# Altium project Mod-player-proto.PrjPcb
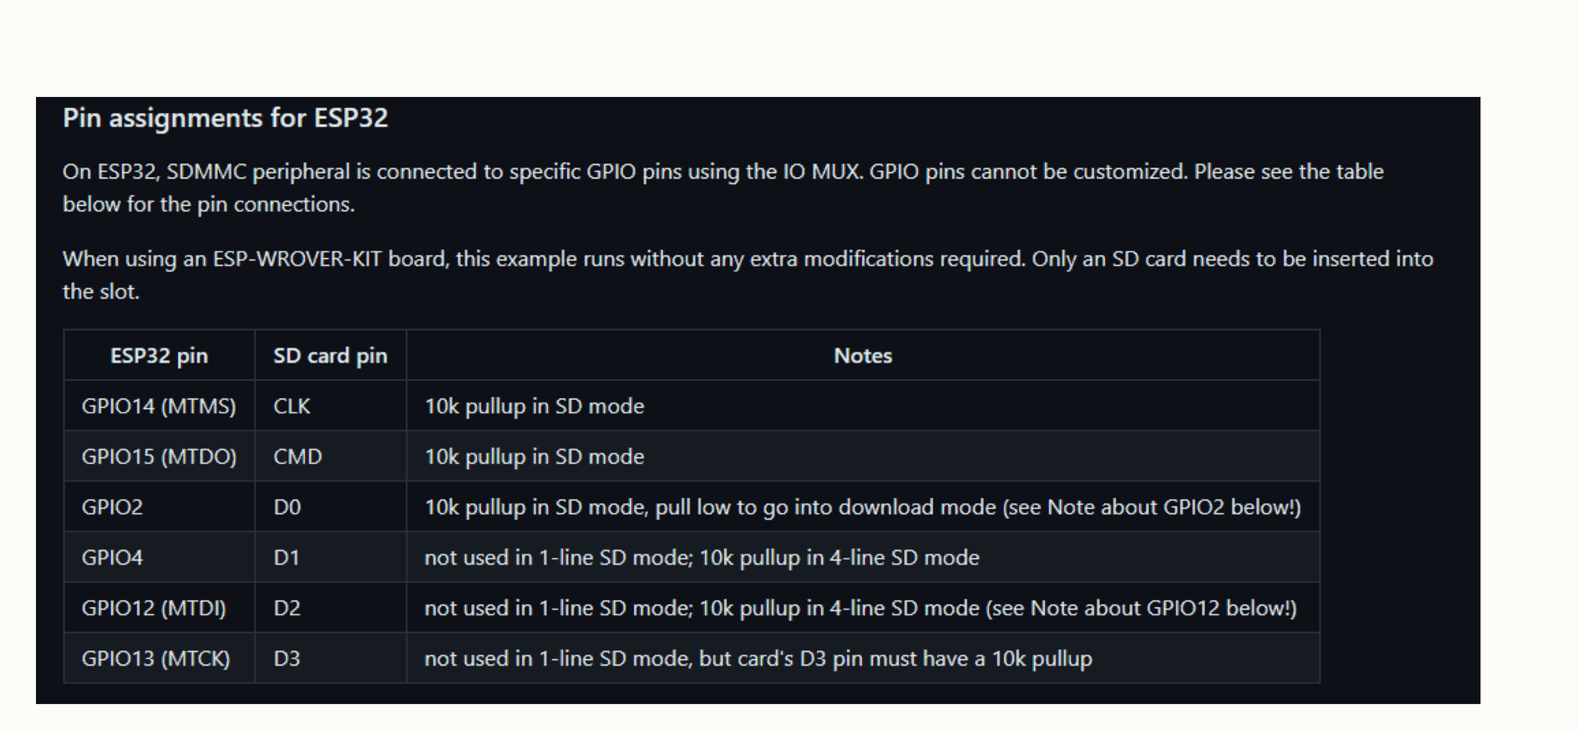
[diagram p0: Sheet1.SchDoc, top left]
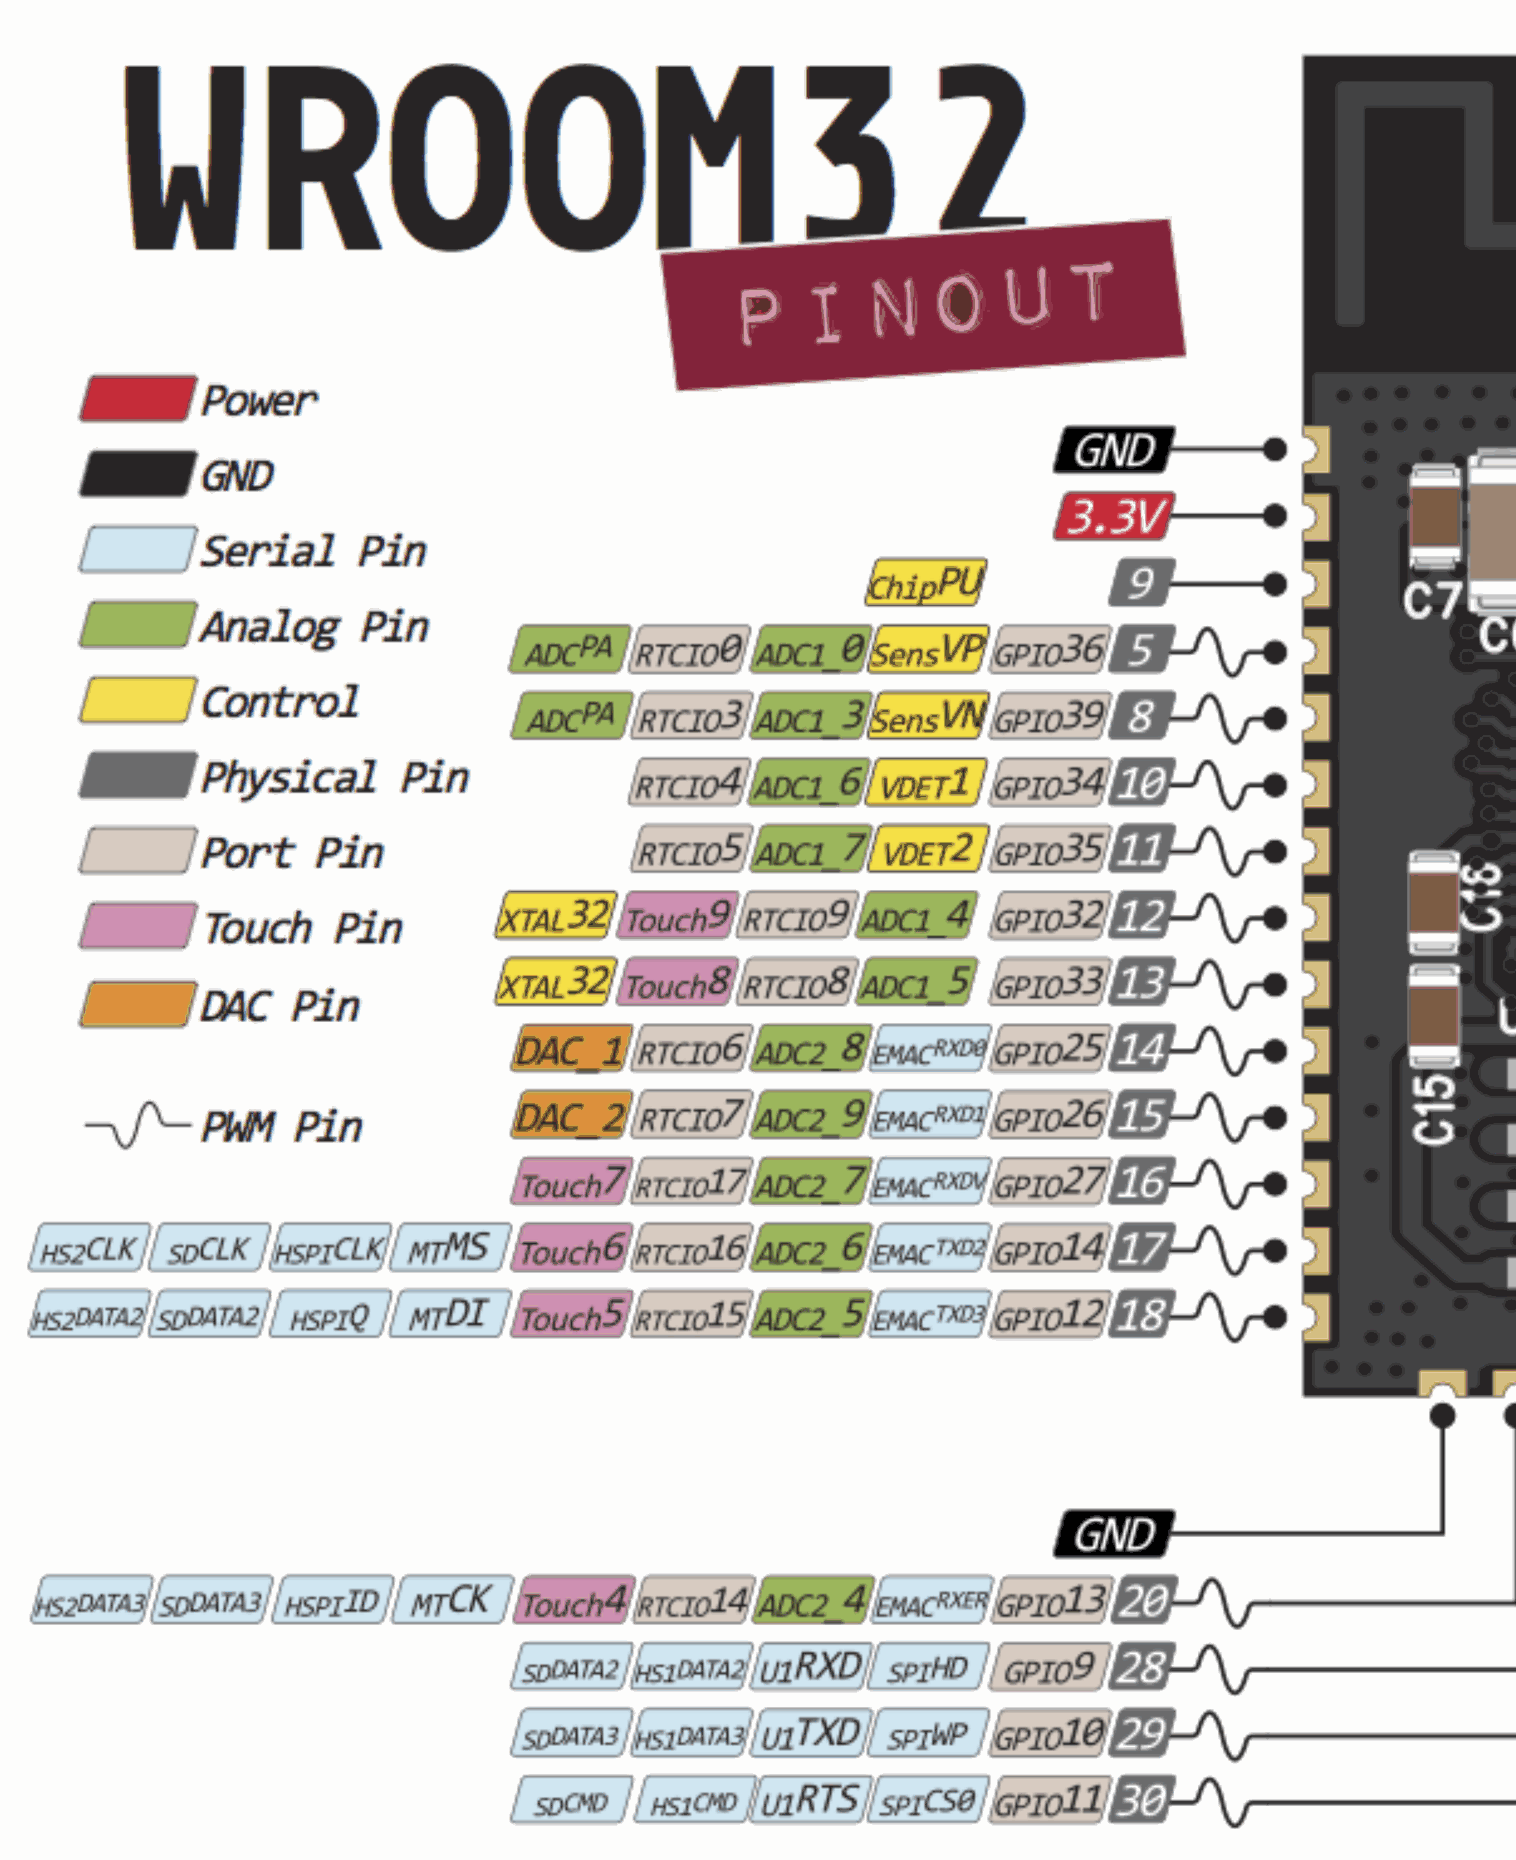
[diagram p1: Sheet1.SchDoc, top middle]
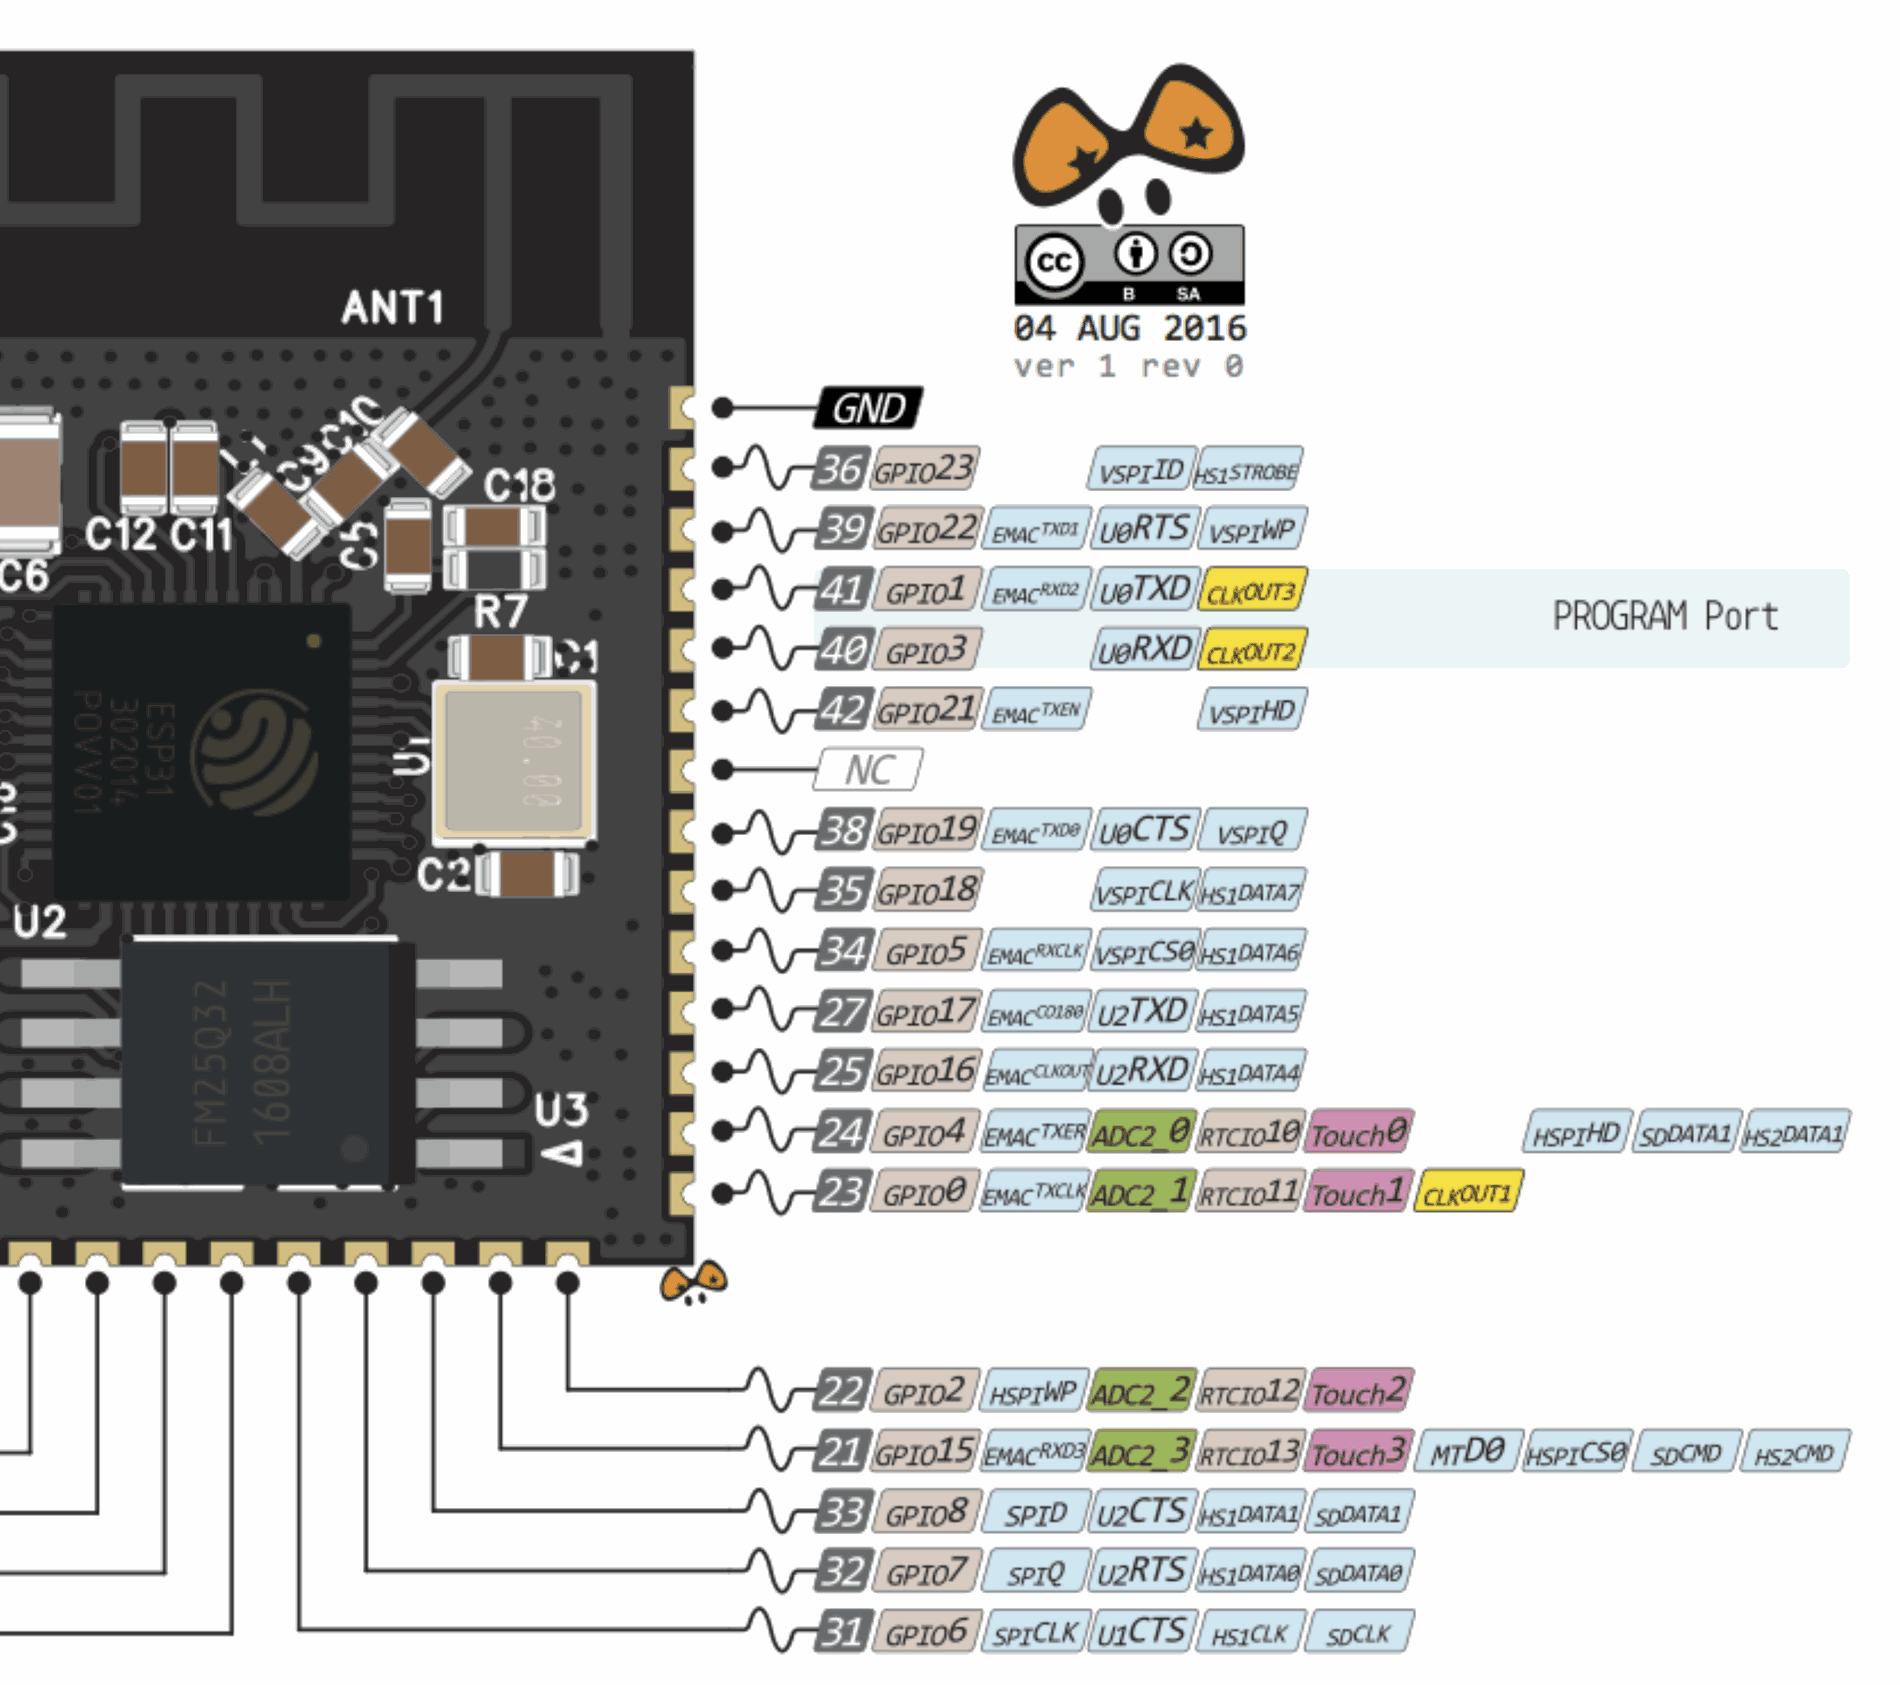
[diagram p2: Sheet1.SchDoc, top right]
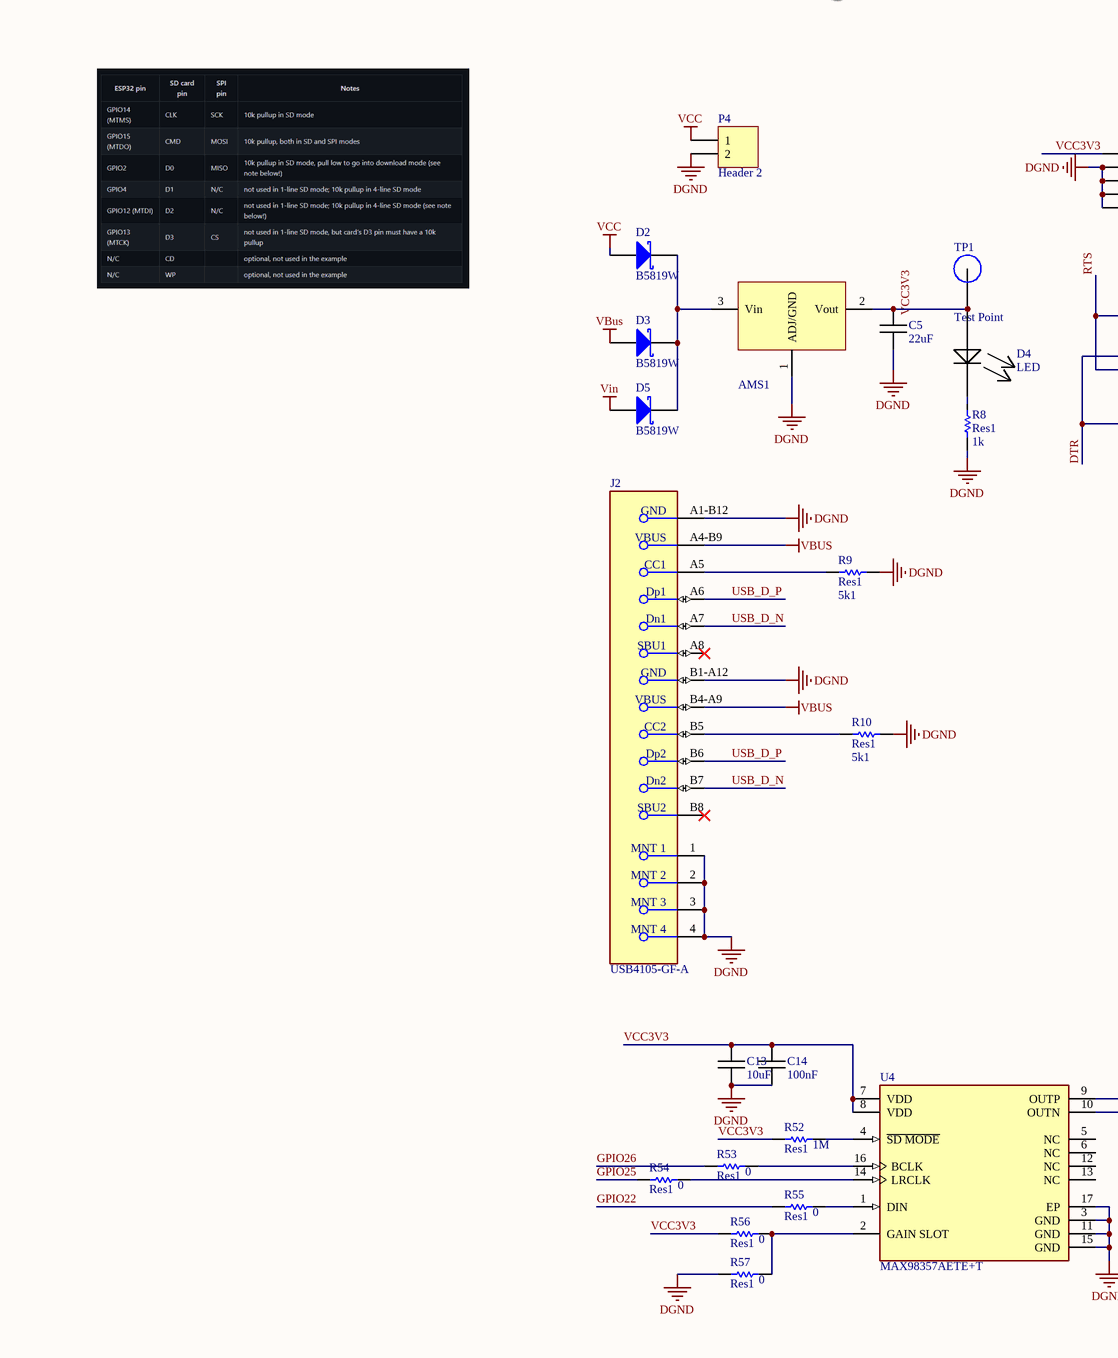
[diagram p3: Sheet1.SchDoc, bottom middle]
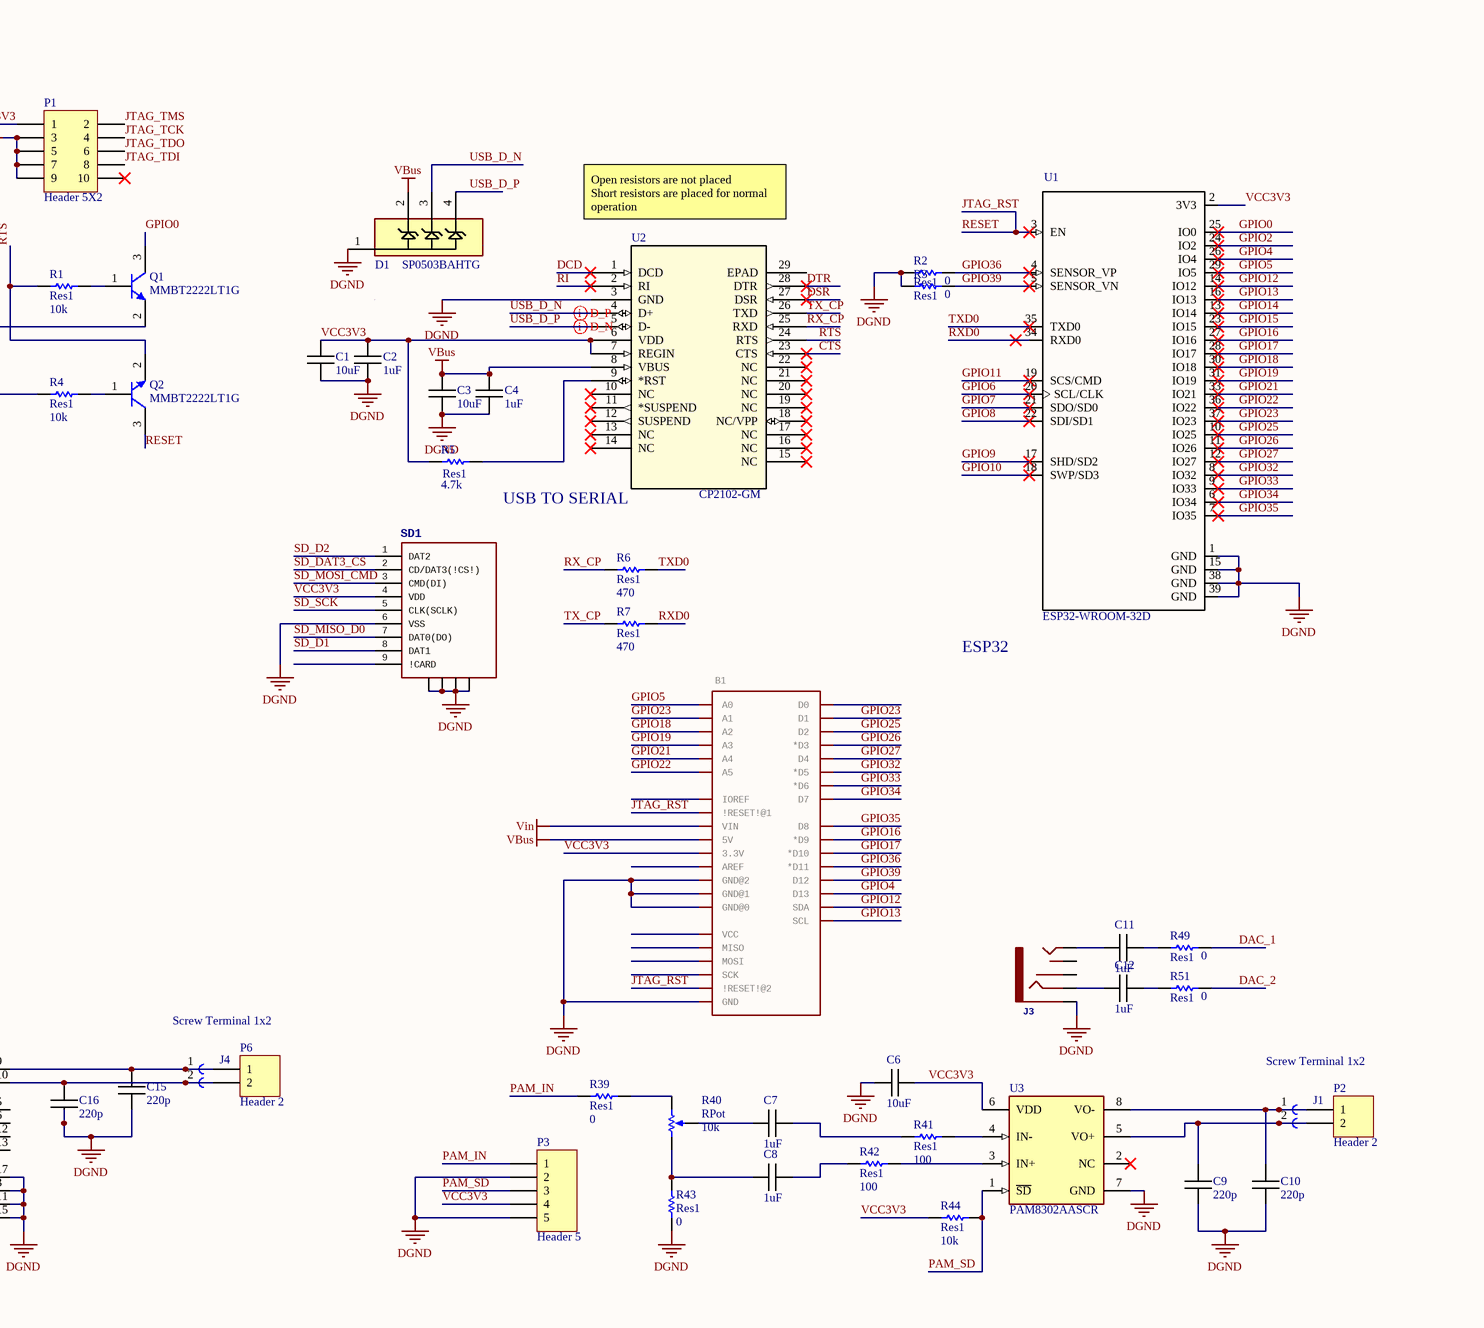
[diagram p4: Sheet1.SchDoc, bottom right]
2 sheets, 116 parts. Net scope: global (net labels, ports and power ports of the same name join across sheets).
Board file: PCB1.PcbDoc
Sheets:
  Sheet1.SchDoc
  Sheet2.SchDoc

## Sheet Sheet1.SchDoc
size B; SheetNumber: 1; SheetTotal: 2

### Parts
AMS1  AMS1117  [SOT-223-3]  (value not drawn)
B1  Arduino R3 Footprint with SPI header Arduino Uno R3 Compatible Footprint. Matches PCB size of the original board.    SparkFun Products:  SAMD21 Dev Breakout  RedBoard   R3 Stackable Headers  [ARDUINO_R3]  (value not drawn)
C1  10uF  [C 0603 / 1608]
C2  1uF  [C 0603 / 1608]
C3  10uF  [C 0603 / 1608]
C4  1uF  [C 0603 / 1608]
C5  22uF  [C 0603 / 1608]
C6  10uF  [C 0603 / 1608]
C7  1uF  [C 0603 / 1608]
C8  1uF  [C 0603 / 1608]
C9  220p  [C 0603 / 1608]
C10  220p  [C 0603 / 1608]
C11  1uF  [C 0603 / 1608]
C12  1uF  [C 0603 / 1608]
C13  10uF  [C 0603 / 1608]
C14  100nF  [C 0603 / 1608]
C15  220p  [C 0603 / 1608]
C16  220p  [C 0603 / 1608]
D1  Part Number: SP0503BAHTG  [Littelfuse_SP0503BAHTG_0]  (hidden comment: Diode_Littelfuse_SP0503BAHTG_eec)
D2  B5819W  [MCC-SOD123_V]
D3  B5819W  [MCC-SOD123_V]
D4  LED  [LED 0603(2)]
D5  B5819W  [MCC-SOD123_V]
J1  Screw Terminal 1x2  [SCREWTERMINAL-5MM-2 - duplicate]
J2  USB4105-GF-A  [FP-USB4105-GF-A-MFG]
J3  Audio Jack 3.5mm variants of PTH and SMT stereo audio jack with bypass switches.SparkFun Products:  [AUDIO-JACK-3.5MM-SMD]  (value not drawn)
J4  Screw Terminal 1x2  [SCREWTERMINAL-5MM-2 - duplicate]
P1  Header 5X2  [HDR2X5]
P2  Header 2  [HDR1X2]
P3  Header 5  [HDR1X5]
P4  Header 2  [HDR1X2]
P6  Header 2  [HDR1X2]
Q1  MMBT2222LT1G  [ONSC-SOT-23-3-318-08_M]
Q2  MMBT2222LT1G  [ONSC-SOT-23-3-318-08_M]
R1  Res1  value 10k  [C 0603 / 1608]
R2  Res1  value 0  [C 0603 / 1608]
R3  Res1  value 0  [C 0603 / 1608]
R4  Res1  value 10k  [C 0603 / 1608]
R5  Res1  value 4.7k  [C 0603 / 1608]
R6  Res1  value 470  [C 0603 / 1608]
R7  Res1  value 470  [C 0603 / 1608]
R8  Res1  value 1k  [C 0603 / 1608]
R9  Res1  value 5k1  [C 0603 / 1608]
R10  Res1  value 5k1  [C 0603 / 1608]
R39  Res1  value 0  [C 0603 / 1608]
R40  RPot  value 10k  [SMD_POT_3x3mm]
R41  Res1  value 100  [C 0603 / 1608]
R42  Res1  value 100  [C 0603 / 1608]
R43  Res1  value 0  [C 0603 / 1608]
R44  Res1  value 10k  [C 0603 / 1608]
R49  Res1  value 0  [C 0603 / 1608]
R51  Res1  value 0  [C 0603 / 1608]
R52  Res1  value 1M  [C 0603 / 1608]
R53  Res1  value 0  [C 0603 / 1608]
R54  Res1  value 0  [C 0603 / 1608]
R55  Res1  value 0  [C 0603 / 1608]
R56  Res1  value 0  [C 0603 / 1608]
R57  Res1  value 0  [C 0603 / 1608]
SD1  TF / Micro SD socket is PUSH-PUSH type, the card can be pushed into and auto locked and pushed out by simply press the card.    Surface Mounting type.  [TF-PULL]  (value not drawn)
TP1  Test Point  [Test POint]
U1  ESP32-WROOM-32D  [MODULE_ESP32-WROOM-32D]
U2  CP2102-GM  [QFN28_5X5]
U3  PAM8302AASCR  [FP-MSOP-8-MFG]
U4  MAX98357AETE+T  [FP-T1633-4-MFG]

### Nets
DGND: AMS1.1(ADJ/GND) B1.GND@1(GND) B1.GND@2(GND@0) B1.GND@3(GND@1) B1.GND@4(GND@2) C1.1 C2.1 C3.1 C4.1 C5.1 C6.1 C9.2 C10.2 C13.1 C14.1 C15.2 C16.2 D1.1(COMMON_ANODE) J2.1(MNT_1) J2.2(MNT_2) J2.3(MNT_3) J2.4(MNT_4) J2.A1-B12(GND) J2.B1-A12(GND) J3.SLEEVE P1.3 P1.5 P1.7 P1.9 P3.2 P3.5 P4.2 R2.1 R3.1 R8.2 R9.1 R10.1 R43.2 R57.1 SD1.6(VSS) SD1.S1 SD1.S2 SD1.S3 SD1.S4 U1.1(GND) U1.15(GND) U1.38(GND) U1.39(GND) U2.3(GND) U3.7(GND) U4.3(GND) U4.11(GND) U4.15(GND) U4.17(EP)
VBus: B1.5V C3.2 C4.2 D1.2(1_CATHODE) D3.1(A) J2.A4-B9(VBUS) J2.B4-A9(VBUS) U2.8(VBUS)
VCC: D2.1(A) P4.1
Vin: B1.VIN D5.1(A)
CTS: U2.23(CTS)
DAC_1: R49.2
DAC_2: R51.2
DCD: U2.1(DCD)
DSR: U2.27(DSR)
DTR: Q1.2(E) R4.1 U2.28(DTR)
GPIO0: Q1.3(C) U1.25(IO0)
GPIO2: U1.24(IO2)
GPIO4: B1.D13 U1.26(IO4)
GPIO5: B1.A0 U1.29(IO5)
GPIO6: U1.20(SCL/CLK)
GPIO7: U1.21(SDO/SD0)
GPIO8: U1.22(SDI/SD1)
GPIO9: U1.17(SHD/SD2)
GPIO10: U1.18(SWP/SD3)
GPIO11: U1.19(SCS/CMD)
GPIO12: B1.SDA U1.14(IO12)
GPIO13: B1.SCL U1.16(IO13)
GPIO14: U1.13(IO14)
GPIO15: U1.23(IO15)
GPIO16: B1.D9(*D9) U1.27(IO16)
GPIO17: B1.D10(*D10) U1.28(IO17)
GPIO18: B1.A2 U1.30(IO18)
GPIO19: B1.A3 U1.31(IO19)
GPIO21: B1.A4 U1.33(IO21)
GPIO22: B1.A5 R55.1 U1.36(IO22)
GPIO23: B1.A1 B1.D1 U1.37(IO23)
GPIO25: B1.D2 R54.1 U1.10(IO25)
GPIO26: B1.D3(*D3) R53.1 U1.11(IO26)
GPIO27: B1.D4 U1.12(IO27)
GPIO32: B1.D5(*D5) U1.8(IO32)
GPIO33: B1.D6(*D6) U1.9(IO33)
GPIO34: B1.D7 U1.6(IO34)
GPIO35: B1.D8 U1.7(IO35)
GPIO36: B1.D11(*D11) R2.2 U1.4(SENSOR_VP)
GPIO39: B1.D12 R3.2 U1.5(SENSOR_VN)
JTAG_RST: B1.RESET@1(!RESET!@1) B1.RESET@2(!RESET!@2) Q2.3(C) U1.3(EN)  [also labelled RESET]
JTAG_TCK: P1.4
JTAG_TDI: P1.8
JTAG_TDO: P1.6
JTAG_TMS: P1.2
PAM_IN: P3.1 R39.1
PAM_SD: P3.3 R44.1 U3.1(~{SD})
RI: U2.2(RI)
RTS: Q2.2(E) R1.1 U2.24(RTS)
RX_CP: R6.1 U2.25(RXD)
RXD0: R7.2 U1.34(RXD0)
SD_D1: SD1.8(DAT1)
SD_D2: SD1.1(DAT2)
SD_DAT3_CS: SD1.2(CD/DAT3(!CS!))
SD_MISO_D0: SD1.7(DAT0(DO))
SD_MOSI_CMD: SD1.3(CMD(DI))
SD_SCK: SD1.5(CLK(SCLK))
TX_CP: R7.1 U2.26(TXD)
TXD0: R6.2 U1.35(TXD0)
USB_D_N: D1.3(2_CATHODE) J2.A7(Dn1) J2.B7(Dn2) U2.4(D+)
USB_D_P: D1.4(3_CATHODE) J2.A6(Dp1) J2.B6(Dp2) U2.5(D-)
VCC3V3: B1.3.3V C1.2 C2.2 C6.2 C13.2 C14.2 P1.1 P3.4 R5.1 R44.2 R52.1 R56.1 SD1.4(VDD) U1.2(3V3) U2.6(VDD) U2.7(REGIN) U3.6(VDD) U4.7(VDD) U4.8(VDD)
NetAMS1_2: AMS1.2(Vout) C5.2 D4.1(+) TP1.1
NetAMS1_3: AMS1.3(Vin) D2.2(K) D3.2(K) D5.2(K)
NetC7_1: C7.1 R41.2
NetC7_2: C7.2 R40.2(TAP)
NetC8_1: C8.1 R42.2
NetC8_2: C8.2 R40.1(TOP) R43.1
NetC9_1: C9.1 J1.2 P2.2 U3.5(VO+)
NetC10_1: C10.1 J1.1 P2.1 U3.8(VO-)
NetC11_1: C11.1 R49.1
NetC11_2: C11.2 J3.TIP
NetC12_1: C12.1 R51.1
NetC12_2: C12.2 J3.RING
NetC15_1: C15.1 J4.1 P6.1 U4.9(OUTP)
NetC16_1: C16.1 J4.2 P6.2 U4.10(OUTN)
NetD4_2: D4.2(-) R8.1
NetJ2_A5: J2.A5(CC1) R9.2
NetJ2_B5: J2.B5(CC2) R10.2
NetQ1_1: Q1.1(B) R1.2
NetQ2_1: Q2.1(B) R4.2
NetR5_2: R5.2 U2.9(*RST)
NetR39_2: R39.2 R40.3(BOT)
NetR41_1: R41.1 U3.4(IN-)
NetR42_1: R42.1 U3.3(IN+)
NetR52_2: R52.2 U4.4(~{SD_MODE})
NetR53_2: R53.2 U4.16(BCLK)
NetR54_2: R54.2 U4.14(LRCLK)
NetR55_2: R55.2 U4.1(DIN)
NetR56_2: R56.2 R57.2 U4.2(GAIN_SLOT)

Not connected (* = marked no-connect by the designer): B1 AREF D0 IOREF MISO MOSI SCK VCC; J2 A8(SBU1)* B8(SBU2)*; J3 RSH TSH; P1 10*; SD1 9(!CARD); U2 10(NC)* 11(*SUSPEND)* 12(SUSPEND)* 13(NC)* 14(NC)* 15(NC)* 16(NC)* 17(NC)* 18(NC/VPP)* 19(NC)* 20(NC)* 21(NC)* 22(NC)* 29(EPAD); U3 2(NC)*; U4 5(NC) 6(NC) 12(NC) 13(NC)

### Layout directives
differential pair: USB_D_N, USB_D_P

### Notes on the sheet
- Open resistors are not placed
  Short resistors are placed for normal operation
- USB TO SERIAL
- ESP32
- Labels drawn without touching a wire or pin: VCC3V3

### Library data of the parts
AMS1 = AMS1117: LDO 3.3V/5V/12V
B1 = ARDUINO_UNO_R3: GateName_1: G$1; SymbolName_1: ARDUINO_R3; LibraryName: SparkFun-Boards; DeviceSetName: ARDUINO_UNO_R3; Package: ARDUINO_R3
C1-C16 = Capacitor
D1 = Diode_Littelfuse_SP0503BAHTG_eec: DIODE TVS DIODE 5.5VWM 8.5VC SOT143; helpURL: https://upverter.com/upn/revision/6b5b591e3bf31c16/; ComponentLink2Description: Datasheet; Temperature: -40°C to +85°C; Package: SOT143-4; Supplier 2: Mouser; Price: 0.571399033067; Supplier 1: Digi-Key; ComponentLink1URL: https://upverter.com/upn/revision/6b5b591e3bf31c16/; Supplier Part Number 2: 576-SP0503BAHTG; Supplier Part Number 1: F2715CT-ND; Manufacturer: Littelfuse; ComponentLink1Description: Upverter; ComponentLink2URL: http://www.littelfuse.com/~/media/electronics/datasheets/tvs_diode_arrays/littelfuse_tvs_diode_array_sp05_datasheet.pdf.pdf; RoHS: TRUE; Mouser Part Number: 576-SP0503BAHTG; Temperature Range High: +85°C; Digikey Description: DIODE TVS DIODE 5.5VWM 8.5VC SOT143; Digikey Part Number: F2715CT-ND; Lead Free: yes; Temperature Range Low: -40°C
D2 D3 D5 = CMP-2100-03587-1: Schottky Barrier Rectifier, 1 A, 40 Vrm, -65 to 125 degC, 2-Pin SOD123, RoHS, Tape and Reel; Manufacturer: Micro Commercial Components; Package Description: 2-Pin Small Outline Diode, Body 2.7 x 1.6 mm, Height 1.35 mm; Datasheet URL: http://www.mccsemi.com/up_pdf/B5817W-B5819W(SOD-123).pdf; Manufacturer URL: http://www.mccsemi.com/; Package Reference: SOD123; Package URL: http://www.mccsemi.com/up_pdf/1N4448W(SOD-123).pdf; Datasheet Version: Rev. B, 01/2013
J1 J4 = Screw Terminal 1x2: 102 Series 5mm Pitch Straight, PCB Terminal Block, Through Hole, 2 Way; MF: Wurth Electronics; MP: 691102710002; SnapEDA_Link: https://www.snapeda.com/parts/691102710002/Wurth%20Electronics%20Inc/view-part/?ref=snap; Price: 0.68 USD; Package: None; Availability: Warning; Value: *
J2 = CMP-245163-000001-1: CONN RCPT USB2.0 TYPEC 5A; Manufacturer: GCT; Description: USB - C (Type - C) USB 2.0 Receptacle Connector 24 Position Surface Mount, Right Angle; Through Hole; Voltage Rating: 20V; Is Female: yes; Current Rating: 5/6.25/1.25/0.25A; Number Of Contacts: 16; Conn Orientation: Right Angle; Device Class L1: Connectors; Category: Conn; Lead Free: Yes; RoHS: TRUE; Temperature Range High: +85°C; Digikey Description: CONN RCPT USB2.0 TYPEC 5A; Device Class L3: unset; ComponentLink2Description: Datasheet; Manufacturer Part Number: USB4105-GF-A; Package: 0; Usb Standard: USB 2.0; Device Class L2: USB Connectors; Automotive: No; Temperature Range Low: -40°C; Height: 3.46mm; Temperature: -40°C to +85°C; Contact Material: Gold,Nickel; ComponentLink2URL: https://gct.co/files/drawings/usb4105.pdf; Octopart: https://octopart.com/usb4105-gf-a-gct-106627878
J3 = AUDIO_JACK_3.5MM_SMD: GateName_1: G$1; SymbolName_1: AUDIO-JACK2; DeviceName: _SMD; PROD_ID: CONN-10353; LibraryName: SparkFun-Connectors; DeviceSetName: AUDIO_JACK_3.5MM; Package: AUDIO-JACK-3.5MM-SMD
P1 = Header 5X2: Header, 5-Pin, Dual row; LatestRevisionDate: 17-Jul-2002; LatestRevisionNote: Re-released for DXP Platform.; Publisher: Altium Limited
P2 P4 P6 = Header 2: Header, 2-Pin; LatestRevisionDate: 17-Jul-2002; LatestRevisionNote: Re-released for DXP Platform.; Publisher: Altium Limited
P3 = Header 5: Header, 5-Pin; LatestRevisionDate: 17-Jul-2002; LatestRevisionNote: Re-released for DXP Platform.; Publisher: Altium Limited
Q1 Q2 = CMP-0722-00001-1: General Purpose Transistor, NPN, 0.6 A IC Continuous, 3-Pin SOT23, RoHS, Tape and Reel; Manufacturer: ON Semiconductor; PTM Max.: 0.225 W; HFE Max.: 300; HFE Min.: 100; V(BR) CEO: 30 V Min.; FT: 250 MHz; IC Continuous: 0.6 A; RoHS: TRUE; DatasheetVersion: Rev. 10; PackageVersion: Rev. AP; Polarity: NPN; PackageReference: SOT-23-3; PackageDescription: 3-Pin SOT23, Body 2.9 x 1.3 mm, Pitch 0.95 mm; ComponentLink1URL: http://www.onsemi.com/; ComponentLink2URL: http://www.onsemi.com/pub_link/Collateral/MMBT2222LT1-D.PDF; PartNumber: MMBT2222LT1G; ComponentLink3URL: http://www.onsemi.com/pub_link/Collateral/MMBT2222LT1-D.PDF; Mounting Technology: Surface Mount; ComponentLink3Description: Package Specification; ComponentLink1Description: Manufacturer URL; Packing: Tape and Reel; ComponentLink2Description: Datasheet
R1-R10 R39 R41-R44 R49 R51-R57 = Res1: Resistor; Published: 8-Jun-2000; LatestRevisionDate: 17-Jul-2002; LatestRevisionNote: Re-released for DXP Platform.; PackageReference: AXIAL-0.3; Publisher: Altium Limited; PackageDescription: Axial Device, Thru-Hole; 2 Leads; 0.3 in Pin Spacing
R40 = RPot: Potentiometer; Sim Note: Enter the Resistance value and the set point into parameter fields.; Set Position: 0.5; Published: 8-Jun-2000; LatestRevisionDate: 17-Jul-2002; LatestRevisionNote: Re-released for DXP Platform.; PackageReference: VR5; Publisher: Altium Limited; PackageDescription: Variable Resistor, Thru-Hole; 3 Leads
SD1 = TF-HOLDER
U1 = ESP32-WROOM-32D: IC: SoC; GPIO, I2C, I2S, IR, SD, SDIO, SPI, UART; 2.7Ã·3.6VDC; 20dBm; MF: Espressif Systems; Availability: Warning; SnapEDA_Link: https://www.snapeda.com/parts/ESP32-WROOM-32D/Espressif%20Systems/view-part/?ref=snap; MP: ESP32-WROOM-32D; Price: 3.98 USD; Package: Module Espressif Systems; Value: *
U2 = CP2102-GM: No Description Available; Vendor: Silicon Labs; Built_By: EMA_UL_Team; Manufacturer_Part_Number: CP2102-GM; Copyright: Copyright (C) 2018 Accelerated Designs. All rights reserved; RefDes: RefDes; Type: DEV; Value: Value
U3 = CMP-12733-000002-1: IC AMP CLASS D MONO 2.5W 8MSOP; Manufacturer: Diodes Inc.; Nominal Supply Current: 4mA; Number Of Channels: 1; Max Junction Temp: +125°C; Min Supply Voltage: 2V; Power At Speaker R: 2.5W @ 4Ω; Max Supply Voltage: 5.5V; Voltage Gain: 24dB; Standoff Height: 0.05mm; Description: Amplifier IC 1-Channel (Mono) Class D 8-MSOP; Manufacturer Part Number: PAM8302AASCR; ComponentLink2URL: https://www.diodes.com/assets/Datasheets/PAM8302A.pdf; Mouser Description: Audio Amplifiers 2.5W MONO FILTERLESS CLASS-D AUDIO AMP; ComponentLink2Description: Datasheet; Temperature: -40°C to +85°C; Automotive: No; Footprint Url: https://www.diodes.com/assets/Package-Files/MSOP-8.pdf; Device Class L1: Integrated Circuits (ICs); Temperature Range Low: -40°C; Temperature Range High: +85°C; Lead Free: Yes; Package: MSOP-8; Height: 1.1mm; Category: IC; Ipc Land Pattern Name: SOP65P490X110-8; Octopart: https://octopart.com/pam8302aascr-diodes+inc.-29030473; RoHS: TRUE; Device Class L3: Amplifiers - Audio; Device Class L2: Linear ICs; Digikey Description: IC AMP CLASS D MONO 2.5W 8MSOP
U4 = CMP-05698-000018-1: IC AMP CLASS D MONO 3.2W 16TQFN; Max Supply Voltage: 5.5V; Max Output Current: 1.6A; Voltage Gain: 15dB; Max Power Dissipation: 1.666W; Min Supply Voltage: 2.5V; Power Supply Rejection Ratio (PSRR): 77dB; Series: -; Contact Plating: Tin; Min Operating Temperature: -40°C; Packaging: Tape and Reel; Max Output Power: 3.2W; Mount: Surface Mount; Number of Pins: 16; RoHS Compliant: Yes; Max Operating Temperature: 85°C; Radiation Hardening: No

## Sheet Sheet2.SchDoc
size A; SheetNumber: 2; SheetTotal: 2
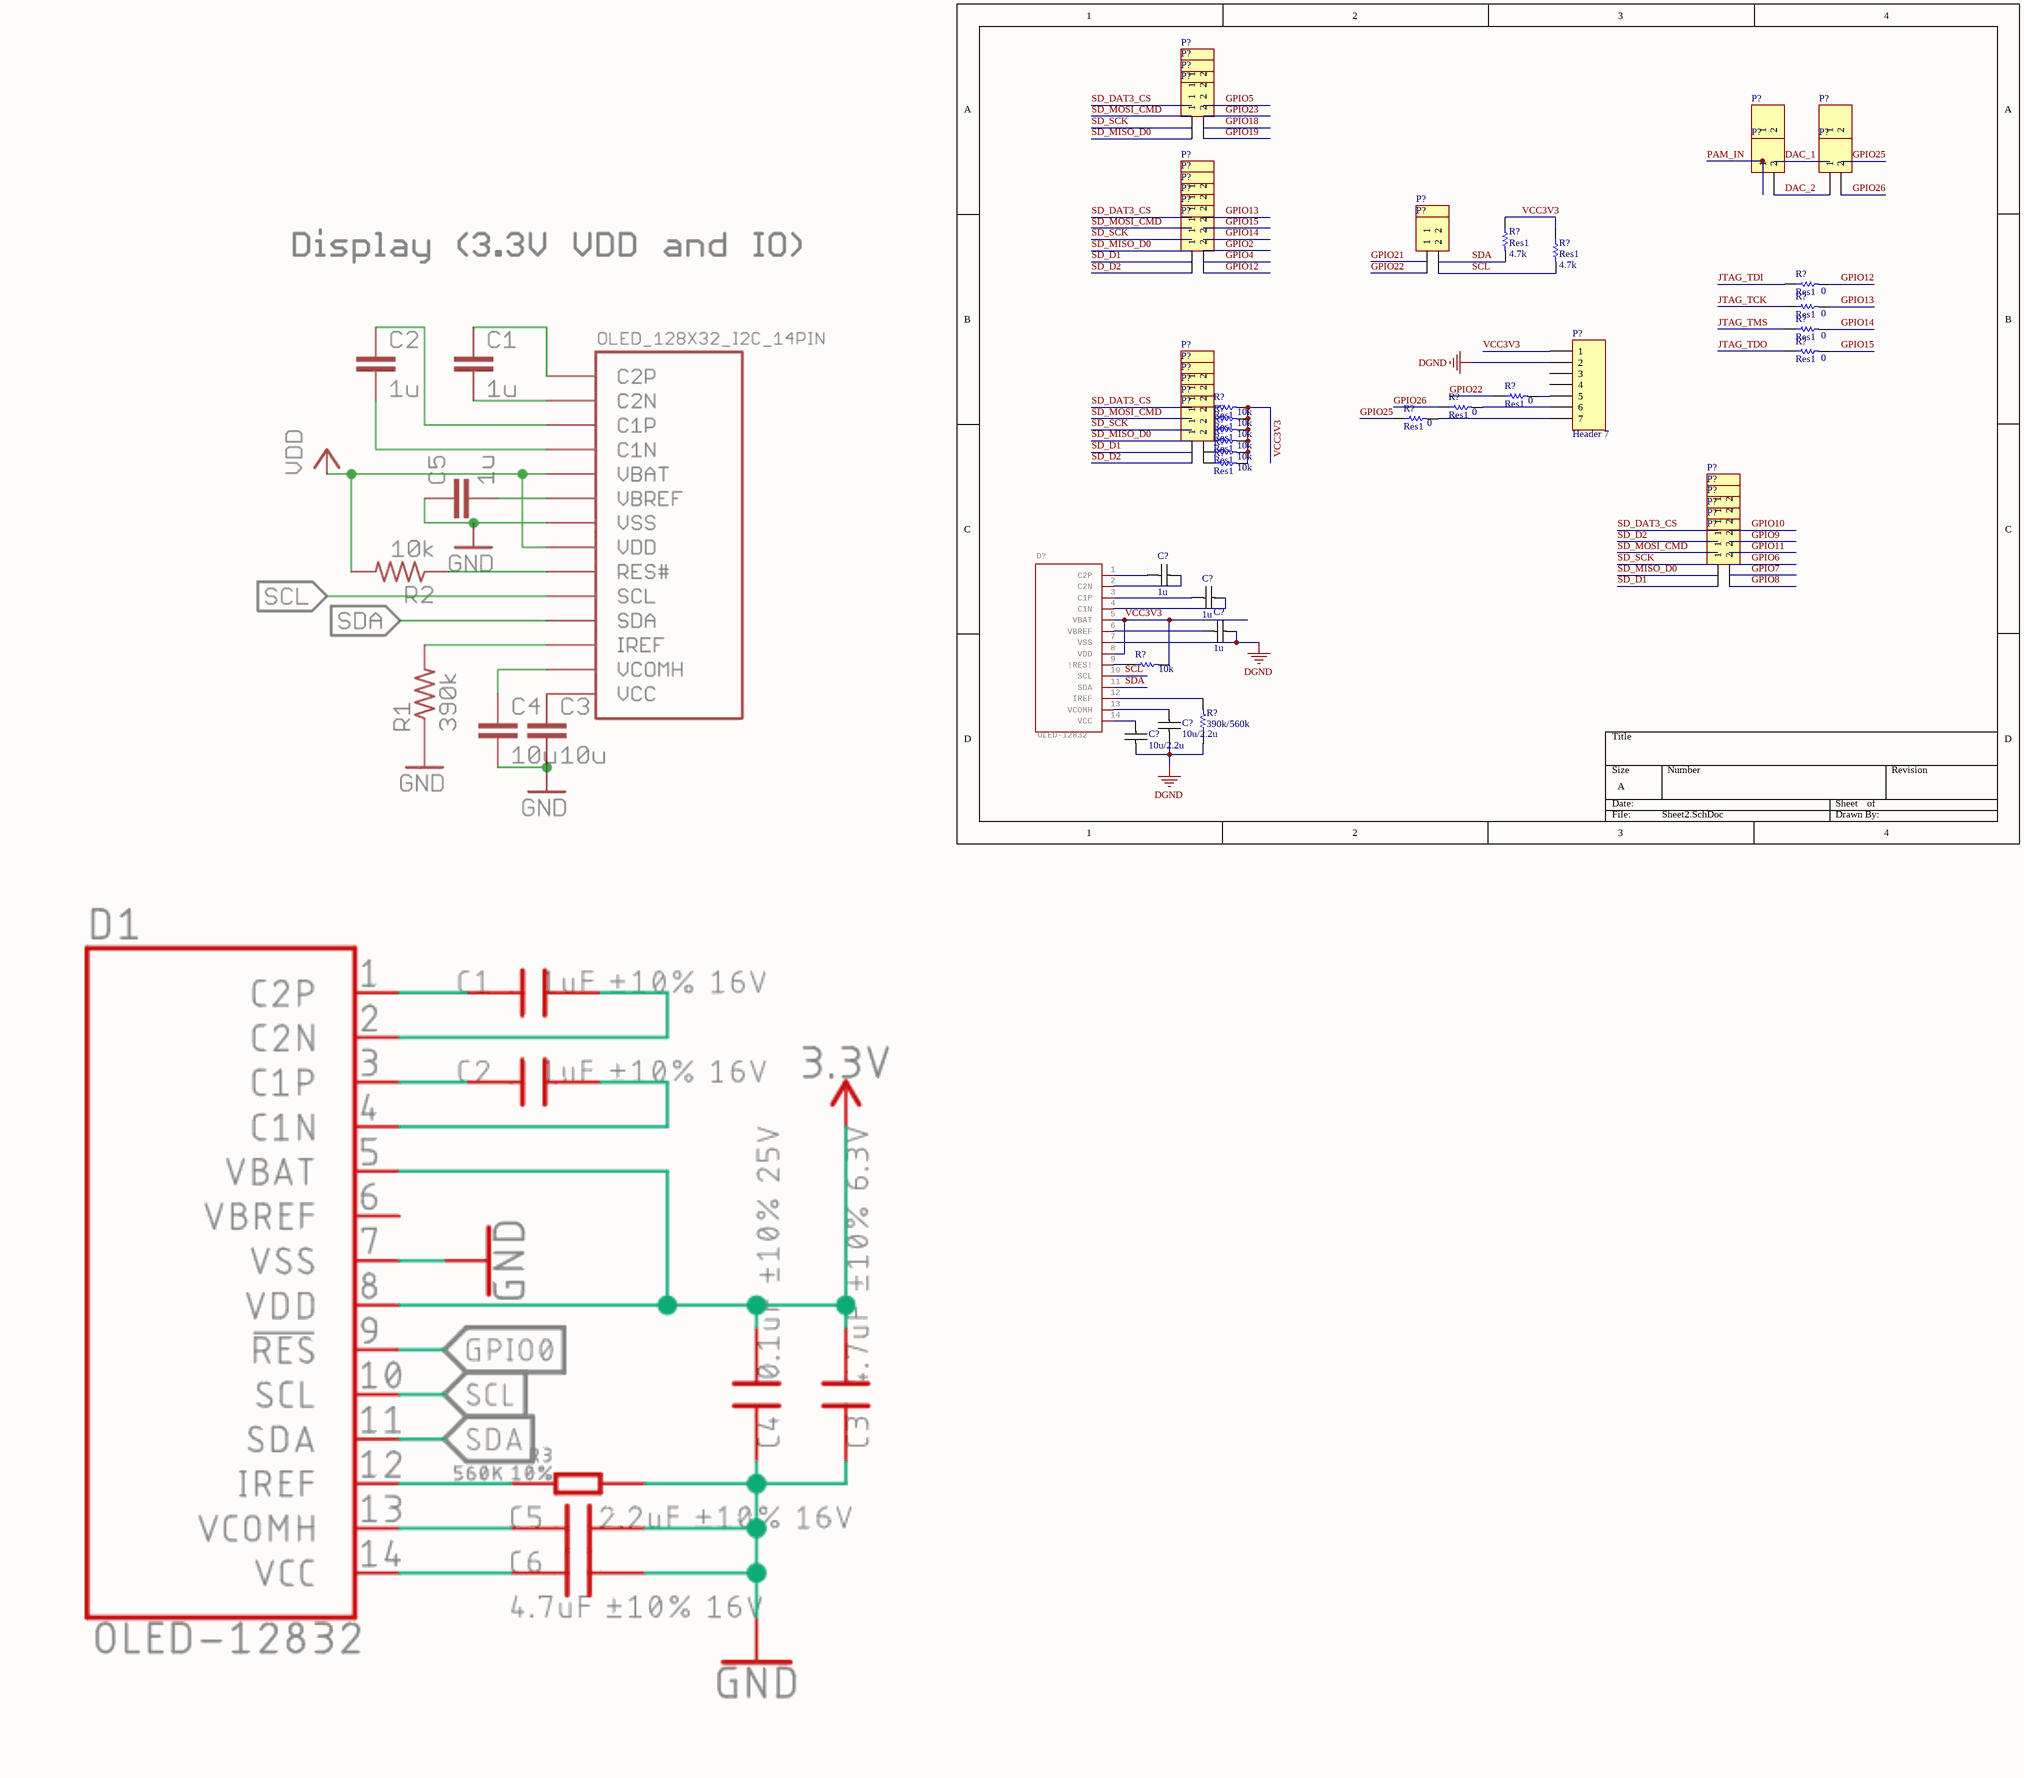
[diagram p5: Sheet2.SchDoc]

### Parts
(Parts that share a designator on the sheet are numbered #1, #2 ... from top to bottom, then left to right.)
C?#1  1u  [C 0603 / 1608]
C?#2  1u  [C 0603 / 1608]
C?#3  1u  [C 0603 / 1608]
C?#4  10u/2.2u  [C 0603 / 1608]
C?#5  10u/2.2u  [C 0603 / 1608]
D?  OLED-12832  [OLED-12832]
P?#1  Header 2  [HDR1X2]  (value not drawn)
P?#2  Header 2  [HDR1X2]  (value not drawn)
P?#3  Header 2  [HDR1X2]  (value not drawn)
P?#4  Header 2  [HDR1X2]  (value not drawn)
P?#5  Header 2  [HDR1X2]  (value not drawn)
P?#6  Header 2  [HDR1X2]  (value not drawn)
P?#7  Header 2  [HDR1X2]  (value not drawn)
P?#8  Header 2  [HDR1X2]  (value not drawn)
P?#9  Header 2  [HDR1X2]  (value not drawn)
P?#10  Header 2  [HDR1X2]  (value not drawn)
P?#11  Header 2  [HDR1X2]  (value not drawn)
P?#12  Header 2  [HDR1X2]  (value not drawn)
P?#13  Header 2  [HDR1X2]  (value not drawn)
P?#14  Header 2  [HDR1X2]  (value not drawn)
P?#15  Header 2  [HDR1X2]  (value not drawn)
P?#16  Header 2  [HDR1X2]  (value not drawn)
P?#17  Header 7  [HDR1X7]
P?#18  Header 2  [HDR1X2]  (value not drawn)
P?#19  Header 2  [HDR1X2]  (value not drawn)
P?#20  Header 2  [HDR1X2]  (value not drawn)
P?#21  Header 2  [HDR1X2]  (value not drawn)
P?#22  Header 2  [HDR1X2]  (value not drawn)
P?#23  Header 2  [HDR1X2]  (value not drawn)
P?#24  Header 2  [HDR1X2]  (value not drawn)
P?#25  Header 2  [HDR1X2]  (value not drawn)
P?#26  Header 2  [HDR1X2]  (value not drawn)
P?#27  Header 2  [HDR1X2]  (value not drawn)
P?#28  Header 2  [HDR1X2]  (value not drawn)
P?#29  Header 2  [HDR1X2]  (value not drawn)
R?#1  Res1  value 4.7k  [C 0603 / 1608]
R?#2  Res1  value 4.7k  [C 0603 / 1608]
R?#3  Res1  value 0  [C 0603 / 1608]
R?#4  Res1  value 0  [C 0603 / 1608]
R?#5  Res1  value 0  [C 0603 / 1608]
R?#6  Res1  value 0  [C 0603 / 1608]
R?#7  Res1  value 0  [C 0603 / 1608]
R?#8  Res1  value 10k  [C 0603 / 1608]
R?#9  Res1  value 0  [C 0603 / 1608]
R?#10  Res1  value 10k  [C 0603 / 1608]
R?#11  Res1  value 0  [C 0603 / 1608]
R?#12  Res1  value 10k  [C 0603 / 1608]
R?#13  Res1  value 10k  [C 0603 / 1608]
R?#14  Res1  value 10k  [C 0603 / 1608]
R?#15  Res1  value 10k  [C 0603 / 1608]
R?#16  value 10k  [C 0603 / 1608]  (hidden comment: Res1)
R?#17  value 390k/560k  [C 0603 / 1608]  (hidden comment: Res1)

### Nets
DGND: C?#3.2 C?#4.1 C?#5.1 D?.7(VSS) P?#17.2 R?#17.1
DAC_1: P?#5.2 P?#6.1
DAC_2: P?#7.2 P?#8.1
GPIO2: P?#12.2
GPIO4: P?#13.2
GPIO5: P?#1.2
GPIO6: P?#27.2
GPIO7: P?#28.2
GPIO8: P?#29.2
GPIO9: P?#25.2
GPIO10: P?#24.2
GPIO11: P?#26.2
GPIO12: P?#15.2 R?#3.2
GPIO13: P?#9.2 R?#4.2
GPIO14: P?#11.2 R?#5.2
GPIO15: P?#10.2 R?#6.2
GPIO18: P?#3.2
GPIO19: P?#4.2
GPIO21: P?#14.1
GPIO22: P?#16.1 R?#7.1
GPIO23: P?#2.2
GPIO25: P?#6.2 R?#11.1
GPIO26: P?#8.2 R?#9.1
JTAG_TCK: R?#4.1
JTAG_TDI: R?#3.1
JTAG_TDO: R?#6.1
JTAG_TMS: R?#5.1
PAM_IN: P?#5.1 P?#7.1
SCL: D?.10(SCL) P?#16.2 R?#2.2
SD_D1: P?#13.1 P?#22.1 P?#29.1
SD_D2: P?#15.1 P?#23.1 P?#25.1
SD_DAT3_CS: P?#1.1 P?#9.1 P?#18.1 P?#24.1
SD_MISO_D0: P?#4.1 P?#12.1 P?#21.1 P?#28.1
SD_MOSI_CMD: P?#2.1 P?#10.1 P?#19.1 P?#26.1
SD_SCK: P?#3.1 P?#11.1 P?#20.1 P?#27.1
SDA: D?.11(SDA) P?#14.2 R?#1.2
VCC3V3: D?.5(VBAT) D?.8(VDD) P?#17.1 R?#1.1 R?#2.1 R?#8.2 R?#10.2 R?#12.2 R?#13.2 R?#14.2 R?#15.2 R?#16.2
NetC?#1_1: C?#1.1 D?.1(C2P)
NetC?#1_2: C?#1.2 D?.2(C2N)
NetC?#2_1: C?#2.1 D?.3(C1P)
NetC?#2_2: C?#2.2 D?.4(C1N)
NetC?#3_1: C?#3.1 D?.6(VBREF)
NetC?#4_2: C?#4.2 D?.13(VCOMH)
NetC?#5_2: C?#5.2 D?.14(VCC)
NetD?_9: D?.9(!RES!) R?#16.1
NetD?_12: D?.12(IREF) R?#17.2
NetP?#17_5: P?#17.5 R?#7.2
NetP?#17_6: P?#17.6 R?#9.2
NetP?#17_7: P?#17.7 R?#11.2
NetP?#18_2: P?#18.2 R?#8.1
NetP?#19_2: P?#19.2 R?#10.1
NetP?#20_2: P?#20.2 R?#12.1
NetP?#21_2: P?#21.2 R?#13.1
NetP?#22_2: P?#22.2 R?#14.1
NetP?#23_2: P?#23.2 R?#15.1

Not connected (* = marked no-connect by the designer): P?#17 3 4

### Library data of the parts
C?#1-C?#5 = Capacitor
D? = OLED-12832: GateName_1: D1; SymbolName_1: OLED-12832; LibraryName: CustomParts; DeviceSetName: OLED-12832; Package: OLED-12832
P?#1-P?#16 P?#18-P?#29 = Header 2: Header, 2-Pin; LatestRevisionDate: 17-Jul-2002; LatestRevisionNote: Re-released for DXP Platform.; Publisher: Altium Limited
P?#17 = Header 7: Header, 7-Pin; LatestRevisionDate: 17-Jul-2002; LatestRevisionNote: Re-released for DXP Platform.; Publisher: Altium Limited
R?#1-R?#17 = Res1: Resistor; Published: 8-Jun-2000; LatestRevisionDate: 17-Jul-2002; LatestRevisionNote: Re-released for DXP Platform.; PackageReference: AXIAL-0.3; Publisher: Altium Limited; PackageDescription: Axial Device, Thru-Hole; 2 Leads; 0.3 in Pin Spacing

## Nets that join several sheets
DGND: Sheet1 (54 pins), Sheet2 (6 pins)
DAC_1: Sheet1 (R49.2), Sheet2 (P?#5.2 P?#6.1)
DAC_2: Sheet1 (R51.2), Sheet2 (P?#7.2 P?#8.1)
GPIO2: Sheet1 (U1.24), Sheet2 (P?#12.2)
GPIO4: Sheet1 (B1.D13 U1.26), Sheet2 (P?#13.2)
GPIO5: Sheet1 (B1.A0 U1.29), Sheet2 (P?#1.2)
GPIO6: Sheet1 (U1.20), Sheet2 (P?#27.2)
GPIO7: Sheet1 (U1.21), Sheet2 (P?#28.2)
GPIO8: Sheet1 (U1.22), Sheet2 (P?#29.2)
GPIO9: Sheet1 (U1.17), Sheet2 (P?#25.2)
GPIO10: Sheet1 (U1.18), Sheet2 (P?#24.2)
GPIO11: Sheet1 (U1.19), Sheet2 (P?#26.2)
GPIO12: Sheet1 (B1.SDA U1.14), Sheet2 (P?#15.2 R?#3.2)
GPIO13: Sheet1 (B1.SCL U1.16), Sheet2 (P?#9.2 R?#4.2)
GPIO14: Sheet1 (U1.13), Sheet2 (P?#11.2 R?#5.2)
GPIO15: Sheet1 (U1.23), Sheet2 (P?#10.2 R?#6.2)
GPIO18: Sheet1 (B1.A2 U1.30), Sheet2 (P?#3.2)
GPIO19: Sheet1 (B1.A3 U1.31), Sheet2 (P?#4.2)
GPIO21: Sheet1 (B1.A4 U1.33), Sheet2 (P?#14.1)
GPIO22: Sheet1 (B1.A5 R55.1 U1.36), Sheet2 (P?#16.1 R?#7.1)
GPIO23: Sheet1 (B1.A1 B1.D1 U1.37), Sheet2 (P?#2.2)
GPIO25: Sheet1 (B1.D2 R54.1 U1.10), Sheet2 (P?#6.2 R?#11.1)
GPIO26: Sheet1 (B1.D3 R53.1 U1.11), Sheet2 (P?#8.2 R?#9.1)
JTAG_TCK: Sheet1 (P1.4), Sheet2 (R?#4.1)
JTAG_TDI: Sheet1 (P1.8), Sheet2 (R?#3.1)
JTAG_TDO: Sheet1 (P1.6), Sheet2 (R?#6.1)
JTAG_TMS: Sheet1 (P1.2), Sheet2 (R?#5.1)
PAM_IN: Sheet1 (P3.1 R39.1), Sheet2 (P?#5.1 P?#7.1)
SD_D1: Sheet1 (SD1.8), Sheet2 (P?#13.1 P?#22.1 P?#29.1)
SD_D2: Sheet1 (SD1.1), Sheet2 (P?#15.1 P?#23.1 P?#25.1)
SD_DAT3_CS: Sheet1 (SD1.2), Sheet2 (P?#1.1 P?#9.1 P?#18.1 P?#24.1)
SD_MISO_D0: Sheet1 (SD1.7), Sheet2 (P?#4.1 P?#12.1 P?#21.1 P?#28.1)
SD_MOSI_CMD: Sheet1 (SD1.3), Sheet2 (P?#2.1 P?#10.1 P?#19.1 P?#26.1)
SD_SCK: Sheet1 (SD1.5), Sheet2 (P?#3.1 P?#11.1 P?#20.1 P?#27.1)
VCC3V3: Sheet1 (19 pins), Sheet2 (12 pins)